# EAGLE schematic untitled (EAGLE 9.4.2)
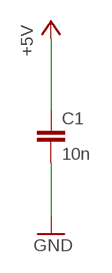
[diagram p0: schematic, sheet 1]

## Parts
C1  10n  C-EUC3216  [C3216]

## Nets
+5V: C1.1
GND: C1.2

## Library data of the parts
C1 = rcl:C-EU: CAPACITOR, European symbol; SPICEPREFIX: C